# Altium schematic sheet 5V_out_driver.SchDoc
size A
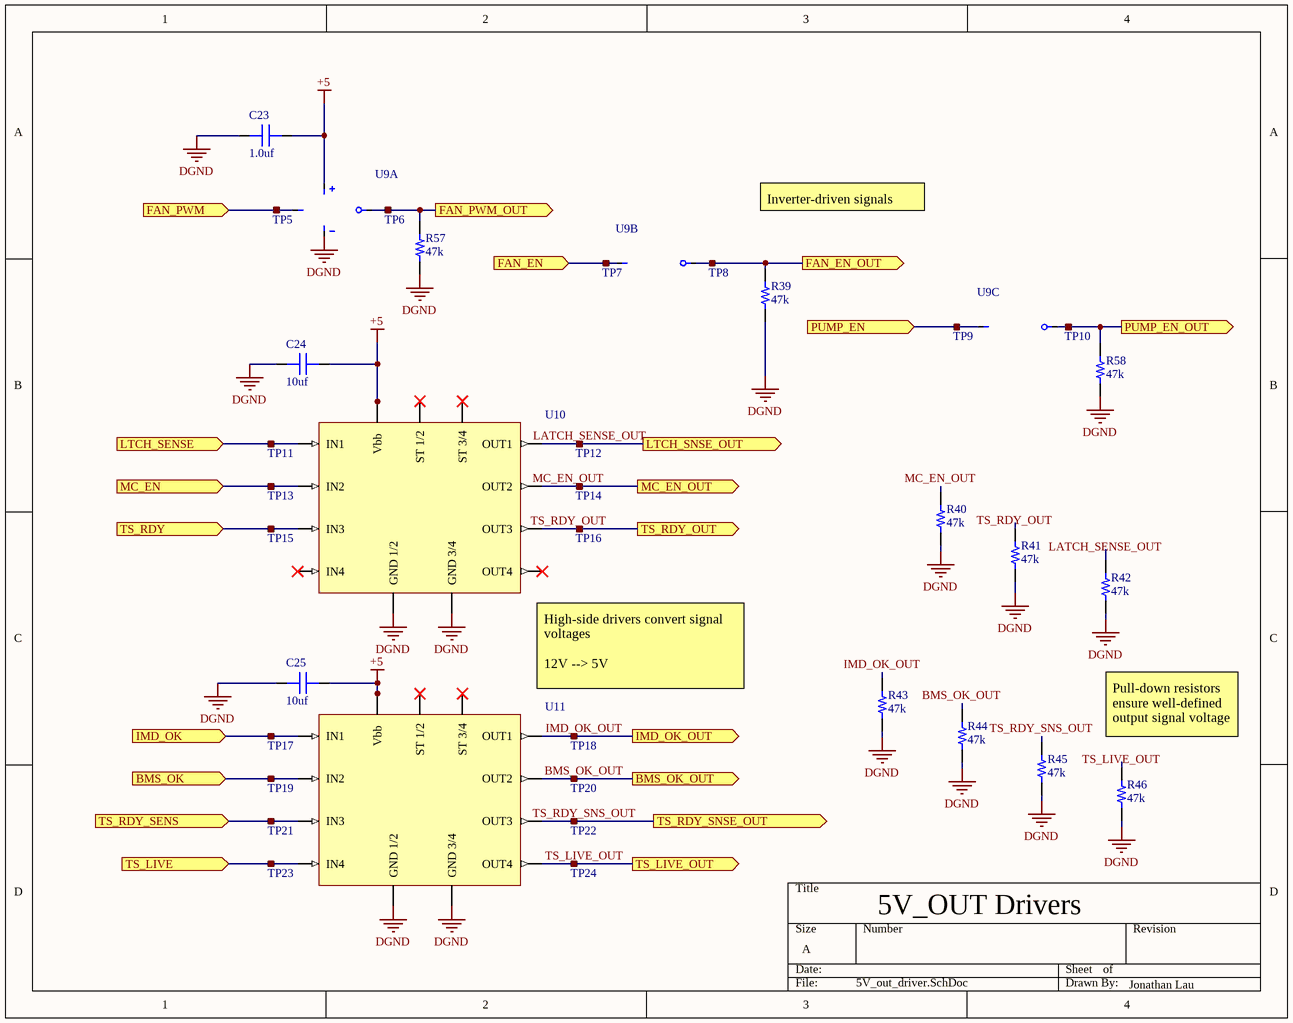
[diagram p0: 5V_out_driver.SchDoc]

## Parts
C23  value 1.0uf  [CAP 0603/1608]  (hidden comment: Capacitor MLCC 1.0uf 16V CAP 0603/1608)
C24  value 10uf  [CAP 0603/1608]  (hidden comment: Capacitor MLCC 10uf 16V CAP 0603/1608)
C25  value 10uf  [CAP 0603/1608]  (hidden comment: Capacitor MLCC 10uf 16V CAP 0603/1608)
R39  value 47k  [RES 0805/2012]  (hidden comment: Resistor 47k 0805 1/4W 5%)
R40  value 47k  [RES 0805/2012]  (hidden comment: Resistor 47k 0805 1/4W 5%)
R41  value 47k  [RES 0805/2012]  (hidden comment: Resistor 47k 0805 1/4W 5%)
R42  value 47k  [RES 0805/2012]  (hidden comment: Resistor 47k 0805 1/4W 5%)
R43  value 47k  [RES 0805/2012]  (hidden comment: Resistor 47k 0805 1/4W 5%)
R44  value 47k  [RES 0805/2012]  (hidden comment: Resistor 47k 0805 1/4W 5%)
R45  value 47k  [RES 0805/2012]  (hidden comment: Resistor 47k 0805 1/4W 5%)
R46  value 47k  [RES 0805/2012]  (hidden comment: Resistor 47k 0805 1/4W 5%)
R57  value 47k  [RES 0805/2012]  (hidden comment: Resistor 47k 0805 1/4W 5%)
R58  value 47k  [RES 0805/2012]  (hidden comment: Resistor 47k 0805 1/4W 5%)
TP5  RCU-0C  [RCU-0C]  (value not drawn)
TP6  RCU-0C  [RCU-0C]  (value not drawn)
TP7  RCU-0C  [RCU-0C]  (value not drawn)
TP8  RCU-0C  [RCU-0C]  (value not drawn)
TP9  RCU-0C  [RCU-0C]  (value not drawn)
TP10  RCU-0C  [RCU-0C]  (value not drawn)
TP11  RCU-0C  [RCU-0C]  (value not drawn)
TP12  RCU-0C  [RCU-0C]  (value not drawn)
TP13  RCU-0C  [RCU-0C]  (value not drawn)
TP14  RCU-0C  [RCU-0C]  (value not drawn)
TP15  RCU-0C  [RCU-0C]  (value not drawn)
TP16  RCU-0C  [RCU-0C]  (value not drawn)
TP17  RCU-0C  [RCU-0C]  (value not drawn)
TP18  RCU-0C  [RCU-0C]  (value not drawn)
TP19  RCU-0C  [RCU-0C]  (value not drawn)
TP20  RCU-0C  [RCU-0C]  (value not drawn)
TP21  RCU-0C  [RCU-0C]  (value not drawn)
TP22  RCU-0C  [RCU-0C]  (value not drawn)
TP23  RCU-0C  [RCU-0C]  (value not drawn)
TP24  RCU-0C  [RCU-0C]  (value not drawn)
U9  SN74LVC3G14DCUR  [R-PDSO-G8]  (value not drawn)  (parts A,B,C of 3)
U10  PG-DSO-20  [PG-DSO-20]  (value not drawn)
U11  PG-DSO-20  [PG-DSO-20]  (value not drawn)

## Ports
BMS_OK (in), BMS_OK_OUT (out), FAN_EN (in), FAN_EN_OUT (out), FAN_PWM (in), FAN_PWM_OUT (out), IMD_OK (in), IMD_OK_OUT (out), LTCH_SENSE (in), LTCH_SNSE_OUT (out), MC_EN (in), MC_EN_OUT (out), PUMP_EN (in), PUMP_EN_OUT (out), TS_LIVE (in), TS_LIVE_OUT (out), TS_RDY (in), TS_RDY_OUT (out), TS_RDY_SENS (in), TS_RDY_SNSE_OUT (out)

## Nets
+5: C23.2 C24.1 C25.1 U9.8(Vcc) U10.1(Vbb) U10.10(Vbb) U10.11(Vbb) U10.12(Vbb) U10.15(Vbb) U10.16(Vbb) U10.19(Vbb) U10.20(Vbb) U11.1(Vbb) U11.10(Vbb) U11.11(Vbb) U11.12(Vbb) U11.15(Vbb) U11.16(Vbb) U11.19(Vbb) U11.20(Vbb)
DGND: C23.1 C24.2 C25.2 R39.1 R40.1 R41.1 R42.1 R43.2 R44.1 R45.1 R46.1 R57.1 R58.1 U9.4(GND) U10.2(GND_1/2) U10.6(GND_3/4) U11.2(GND_1/2) U11.6(GND_3/4)
BMS_OK: TP19.1 U11.5(IN2) ; port BMS_OK
BMS_OK_OUT: R44.2 TP20.1 U11.17(OUT2) ; port BMS_OK_OUT
FAN_EN: TP7.1 U9.3(2A) ; port FAN_EN
FAN_EN_OUT: R39.2 TP8.1 U9.5(2Y) ; port FAN_EN_OUT
FAN_PWM: TP5.1 U9.1(1A) ; port FAN_PWM
FAN_PWM_OUT: R57.2 TP6.1 U9.7(1Y) ; port FAN_PWM_OUT
IMD_OK: TP17.1 U11.3(IN1) ; port IMD_OK
IMD_OK_OUT: R43.1 TP18.1 U11.18(OUT1) ; port IMD_OK_OUT
LATCH_SENSE_OUT: R42.2 TP12.1 U10.18(OUT1) ; port LTCH_SNSE_OUT
LTCH_SENSE: TP11.1 U10.3(IN1) ; port LTCH_SENSE
MC_EN: TP13.1 U10.5(IN2) ; port MC_EN
MC_EN_OUT: R40.2 TP14.1 U10.17(OUT2) ; port MC_EN_OUT
PUMP_EN: TP9.1 U9.6(3A) ; port PUMP_EN
PUMP_EN_OUT: R58.2 TP10.1 U9.2(3Y) ; port PUMP_EN_OUT
TS_LIVE: TP23.1 U11.9(IN4) ; port TS_LIVE
TS_LIVE_OUT: R46.2 TP24.1 U11.13(OUT4) ; port TS_LIVE_OUT
TS_RDY: TP15.1 U10.7(IN3) ; port TS_RDY
TS_RDY_OUT: R41.2 TP16.1 U10.14(OUT3) ; port TS_RDY_OUT
TS_RDY_SENS: TP21.1 U11.7(IN3) ; port TS_RDY_SENS
TS_RDY_SNS_OUT: R45.2 TP22.1 U11.14(OUT3) ; port TS_RDY_SNSE_OUT

Not connected (* = marked no-connect by the designer): U10 4(ST_1/2)* 8(ST_3/4)* 9(IN4)* 13(OUT4)*; U11 4(ST_1/2)* 8(ST_3/4)*

## Notes on the sheet
- Inverter-driven signals
- High-side drivers convert signal voltages
  12V --> 5V
- Pull-down resistors ensure well-defined output signal voltage
- 5V_OUT Drivers
- Jonathan Lau

## Library data of the parts
C23 = 229: Manufacturer_id: 1; idCapacitor: 229; Name: Cap_1.0uf_16V_CAP 0603/1608; Dielectric: Ceramic; Created_By: Nick Mah; Drawer_id: 1; Voltage_Rating: 16V; Package: CAP 0603/1608; Created_Date: 10/20/2018
C24 C25 = 235: Manufacturer_id: 1; idCapacitor: 235; Name: Cap_10uf_16V_CAP 0603/1608; Dielectric: Ceramic; Created_By: Nick Mah; Drawer_id: 1; Voltage_Rating: 16V; Package: CAP 0603/1608; Created_Date: 10/20/2018
R39-R46 R57 R58 = 1841: Manufacturer_id: 1; idResistor: 1841; Name: Res_47k_0805_1/4W_5%; Created_By: Nick Mah; Supplier 1: Digi-Key; Drawer_id: 1; Tolerance: 5%; Power: 1/4W; Package: 0805; ComponentLink1Description: Datasheet; Created_Date: 2018-10-20
TP5-TP24 = 5: Manufacturer_id: 1; idTable: 5; Name: RCU-0C_Test_Point; Drawer_id: 1; Package: 0603; MfrPartNo: RCU-0C; Link: https://www.digikey.com/product-detail/en/te-connectivity-amp-connectors/RCU-0C/A106145CT-ND/3477802; ComponentLink1Description: Datasheet; ComponentLink1URL: https://www.te.com/commerce/DocumentDelivery/DDEController?Action=srchrtrv&DocNm=1773266&DocType=DS&DocLang=English
U9 = 30: Manufacturer_id: 1; idIC_Misc: 30; Name: SN74LVC3G14DCUR Inverter; Drawer_id: 1; Link: https://www.digikey.com/product-detail/en/texas-instruments/SN74LVC3G14DCUR/296-13006-1-ND/475831
U10 U11 = 6: High Side Driver; Manufacturer_id: 1; MfrPartNo: BTS716GXUMA1; idIC_Misc: 6; Name: BTS716G High Side Driver; Drawer_id: 1; Link: https://www.digikey.com/product-detail/en/infineon-technologies/BTS716GXUMA1/BTS716GXUMA1CT-ND/520067; ComponentLink1Description: Datasheet; ComponentLink1URL: https://www.infineon.com/dgdl/Infineon-BTS716G-DS-v01_00-EN.pdf?fileId=5546d4625a888733015aa3be86601004